# Altium schematic sheet Motors.SchDoc
size B; SheetNumber: 1; SheetTotal: 1; SPICEModelCacheGGIVJTOG: <root> / <DocumentId>GGIVJTOG</DocumentId> / </root>
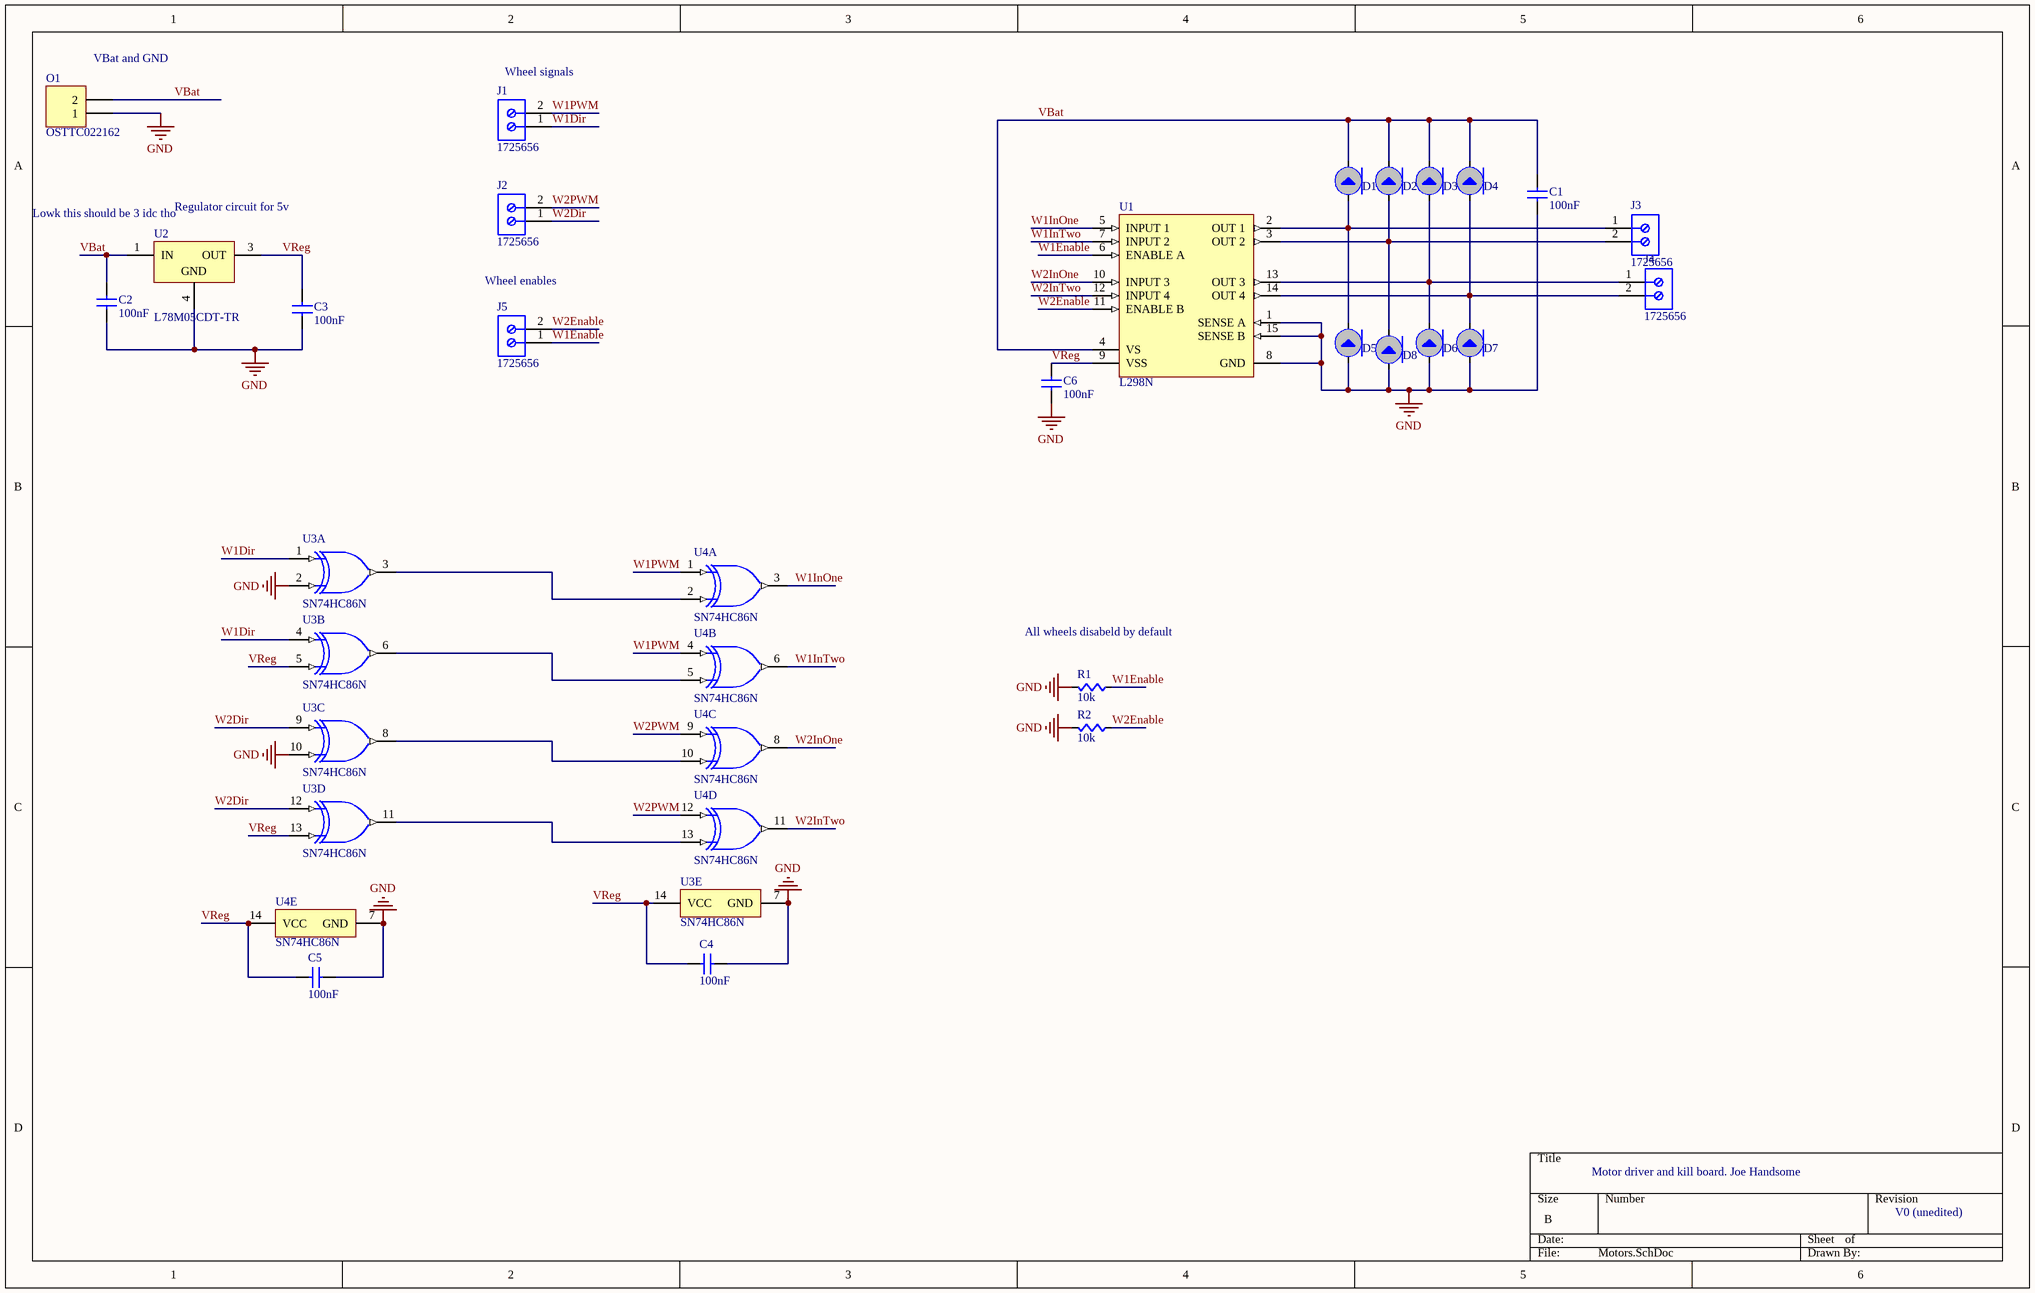
[diagram p0: Motors.SchDoc]

## Parts
C1  value 100nF  [CAPC0603]  (hidden comment: Cap)
C2  value 100nF  [CAPC0603]  (hidden comment: Cap)
C3  value 100nF  [CAPC0603]  (hidden comment: Cap)
C4  value 100nF  [CAPC0603]  (hidden comment: Cap)
C5  value 100nF  [CAPC0603]  (hidden comment: Cap)
C6  value 100nF  [CAPC0603]  (hidden comment: Cap)
D1  Diode  [MBRS360SMB]  (value not drawn)
D2  Diode  [MBRS360SMB]  (value not drawn)
D3  Diode  [MBRS360SMB]  (value not drawn)
D4  Diode  [MBRS360SMB]  (value not drawn)
D5  Diode  [MBRS360SMB]  (value not drawn)
D6  Diode  [MBRS360SMB]  (value not drawn)
D7  Diode  [MBRS360SMB]  (value not drawn)
D8  Diode  [MBRS360SMB]  (value not drawn)
J1  1725656  [PHOE-1725656-2]
J2  1725656  [PHOE-1725656-2]
J3  1725656  [PHOE-1725656-2]
J4  1725656  [PHOE-1725656-2]
J5  1725656  [PHOE-1725656-2]
O1  OSTTC022162  [high_amp_conn]
R1  value 10k  [RES0603]  (hidden comment: Res)
R2  value 10k  [RES0603]  (hidden comment: Res)
U1  L298N  [STM-FM-15]
U2  L78M05CDT-TR  [TO-252_L]
U3  SN74HC86N  [PCBComponent_1]  (parts A,B,C,D,E of 5)
U4  SN74HC86N  [PCBComponent_1]  (parts A,B,C,D,E of 5)

## Nets
GND: C1.2(B) C2.2(B) C3.2(B) C4.2(B) C5.2(B) C6.2(B) D5.A D6.A D7.A D8.A O1.1 R1.1(A) R2.1(A) U1.1(SENSE_A) U1.8(GND) U1.15(SENSE_B) U2.4(GND) U3.2(1B) U3.7(GND) U3.10(3B) U4.7(GND)
VBat: C1.1(A) C2.1(A) D1.C D2.C D3.C D4.C O1.2 U1.4(VS) U2.1(IN)
VReg: C3.1(A) C4.1(A) C5.1(A) C6.1(A) U1.9(VSS) U2.3(OUT) U3.5(2B) U3.13(4B) U3.14(VCC) U4.14(VCC)
W1Dir: J1.1 U3.1(1A) U3.4(2A)
W1Enable: J5.1 R1.2(B) U1.6(ENABLE_A)
W1InOne: U1.5(INPUT_1) U4.3(1Y)
W1InTwo: U1.7(INPUT_2) U4.6(2Y)
W1PWM: J1.2 U4.1(1A) U4.4(2A)
W2Dir: J2.1 U3.9(3A) U3.12(4A)
W2Enable: J5.2 R2.2(B) U1.11(ENABLE_B)
W2InOne: U1.10(INPUT_3) U4.8(3Y)
W2InTwo: U1.12(INPUT_4) U4.11(4Y)
W2PWM: J2.2 U4.9(3A) U4.12(4A)
NetD1_A: D1.A D5.C J3.1 U1.2(OUT_1)
NetD2_A: D2.A D8.C J3.2 U1.3(OUT_2)
NetD3_A: D3.A D6.C J4.1 U1.13(OUT_3)
NetD4_A: D4.A D7.C J4.2 U1.14(OUT_4)
NetU3_3: U3.3(1Y) U4.2(1B)
NetU3_6: U3.6(2Y) U4.5(2B)
NetU3_8: U3.8(3Y) U4.10(3B)
NetU3_11: U3.11(4Y) U4.13(4B)

## Notes on the sheet
- (near O1) VBat and GND
- (near J1) Wheel signals
- (near U2) Lowk this should be 3 idc tho
- (near U2) Regulator circuit for 5v
- Wheel enables
- (near R1) All wheels disabeld by default
- Motor driver and kill board. Joe Handsome
- V0 (unedited)

## Library data of the parts
D1-D8 = Diode: Standard Diode Template
J1-J5 = CMP-2000-05299-1: Male Header, Pitch 2.54 mm, 1 x 2 Position, Height 9 mm, Tail Length 3.5 mm; Manufacturer: Phoenix Contact; Number of contacts: 2; Content: 250pc(s); Pitch: 2.54mm; Industrial packaging: Yes; Colour: Green; Manufacturer part No.: 1725656; Type: MPT0,5/2-2,54; Datasheet URL: http://datasheet.octopart.com/1725656-Phoenix-Contact-datasheet-5302866.pdf; Manufacturer URL: http://www.phoenixcontact.com/; Datasheet Version: Apr-08
O1 = OSTTC022162: Terminal Block Header 2-Position Top Screw 0.200" (5.08mm) PC-Pins; Manufacturer: On-Shore Technology; Plating: Steel; Max Current Rating: 15A; Number of Levels: 1; Number of Positions Per Level: 2; Voltage: 300V; Wire Gauge (Max): 22AWG; Wire Gauge (Min): 14AWG; Supplier: Digikey; Supplier Part Number: ED2609-ND; Manufacturer Part Number: OSTTC022162; RoHS: Yes; Category: Terminal Blocks; Stock: 21701; Pricing: 1=0.88, 10=0.439, 25=0.352, 50=0.3046, 100=0.2691, 250=0.23536, 500=0.21714, 1000=0.20345, 5000=0.18339 (USD); Mounting Technology: Through Hole; Color: Blue; Contact Plating: Tin; Housing Color: Blue; Contact Material: Brass; Housing Material: Thermoplastic; Min Operating Temperature: -30°C; Max Operating Temperature: 105°C; Number of Rows: 1; Packaging: Bulk; Current: 15A; Termination: Screw; Number of Contacts: 2; Number of Positions: 2; Series: OSTTC; Length: 10.2mm; Width: 7.6mm; Height: 10mm; Pitch: 5.08mm; Flammability Rating: UL94 V-0; RoHS Compliant: Yes; ComponentLink1URL: https://datasheet.ciiva.com/19454/2120647-19454560.pdf?src-supplier=Jameco; ComponentLink1Description: https://datasheet.ciiva.com/19454/2120647-19454560.pdf?src-supplier=Jameco; ComponentLink2URL: https://datasheet.ciiva.com/824/osttcxx2162-824893.pdf?src-supplier=Digikey; ComponentLink2Description: https://datasheet.ciiva.com/824/osttcxx2162-824893.pdf?src-supplier=Digikey
U1 = CMP-2000-06526-1: Dual Full-Bridge Driver, 4.8 to 46 V, -40 to 150 degC, 15-Pin FM (MW 15L), RoHS, Tube; Manufacturer: STMicroelectronics; PartNumber: L298; Output Current: 2A; Supply Voltage Max: 7V; Driver Case Style: Multiwatt; Supply Voltage Min: 4.5V; No. of Pins: 15Pins; SVHC: NoSVHC(17-Dec-2015); Output Voltage: 46V; No. of Outputs: 4Outputs; Motor Type: FullBridge; MSL: -; Package Description: 15-Pin Flange Mount, Body 5 x 19.6 mm, Pitch 1.27 mm; Datasheet Version: 01/2000; Package Reference: FM-15; Mounting Technology: ThroughHole; Packaging: Each; Automotive Qualification Standard: -; Product Range: -; Datasheet URL: https://datasheet.ciiva.com/15109/getdatasheetpartid-50682-15109332.pdf; Operating Temperature Max: 130°C; Operating Temperature Min: -25°C; Manufacturer URL: http://www.st.com/
U2 = CMP-0244-00178-1: Positive Voltage Regulator, 5V, 3-Pin DPAK, Tape and Reel; PackageReference: TO-252; ComponentLink1URL: http://www.st.com; ComponentLink2Description: Datasheet; PackageDescription: 3-Pin Transistor Outline Package 2.28 mm Pitch, 9.7 mm Lead Span (DPAK); ComponentLink1Description: Manufacturer URL; DatasheetVersion: 1/11/2010; ComponentLink2URL: http://www.st.com/internet/com/TECHNICAL_RESOURCES/TECHNICAL_LITERATURE/DATASHEET/CD00000447.pdf; PackageVersion: 2011
U3 U4 = CMP-0778-00109-3: Quadruple 2-Input Exclusive-OR Gates, N0014A, TUBE; Manufacturer: Texas Instruments; Technology Family: HC; VCC(Min)(V): 2; F @ Nom Voltage(Max)(Mhz): 70; Input Type: CMOS; tpd @ Nom Voltage(Max)(ns): 21; ICC @ Nom Voltage(Max)(mA): 0.02; Bits(#): 4; Rating: Catalog; VCC(Max)(V): 6; Output Drive (IOL/IOH)(Max)(mA): 5.2/-5.2; Voltage(Nom)(V): 5; Schmitt Trigger: No; DatasheetVersion: SCLS100E; Operating Temperature Range(C): -40 to 85; Output Type: CMOS; Generic Part Number: SN74HC86; PackageReference: N0014A
C1-C6 = Cap: Supplier 1: Digi-Key; Supplier Part Number 1: 1276-1000-1-ND
R1 R2 = Res: Supplier 1: Digi-Key; Supplier Part Number 1: RMCF0603JT10K0CT-ND